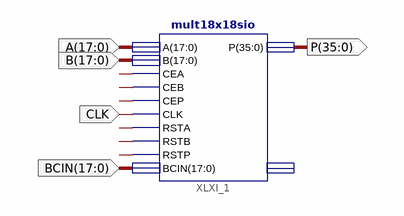
[diagram p0: schematic sheet 1]
// Xilinx ISE schematic multiplicador.sch (spartan6) as structural Verilog: 1 symbols, 5 ports
module multiplicador (
  input  [17:0] B,
  input  [17:0] A,
  input  CLK,
  input  [17:0] BCIN,
  output [35:0] P
);

  wire XLXN_7, XLXN_8, XLXN_9, XLXN_11, XLXN_12, XLXN_13;

  mult18x18sio XLXI_1 (
    .A(A), .B(B), .CEA(XLXN_7), .CEB(XLXN_8), .CEP(XLXN_9), .CLK(CLK), .RSTA(XLXN_11), .RSTB(XLXN_12),
    .RSTP(XLXN_13), .BCIN(BCIN), .P(P));  // open: BCOUT
endmodule
